# Altium schematic sheet Sheet2.SchDoc
size 431 x 279 mm; SheetNumber: 1; SheetTotal: 1; SPICEModelCacheDONSCKSV: <root> / <DocumentId>DONSCKSV</DocumentId> / </root>
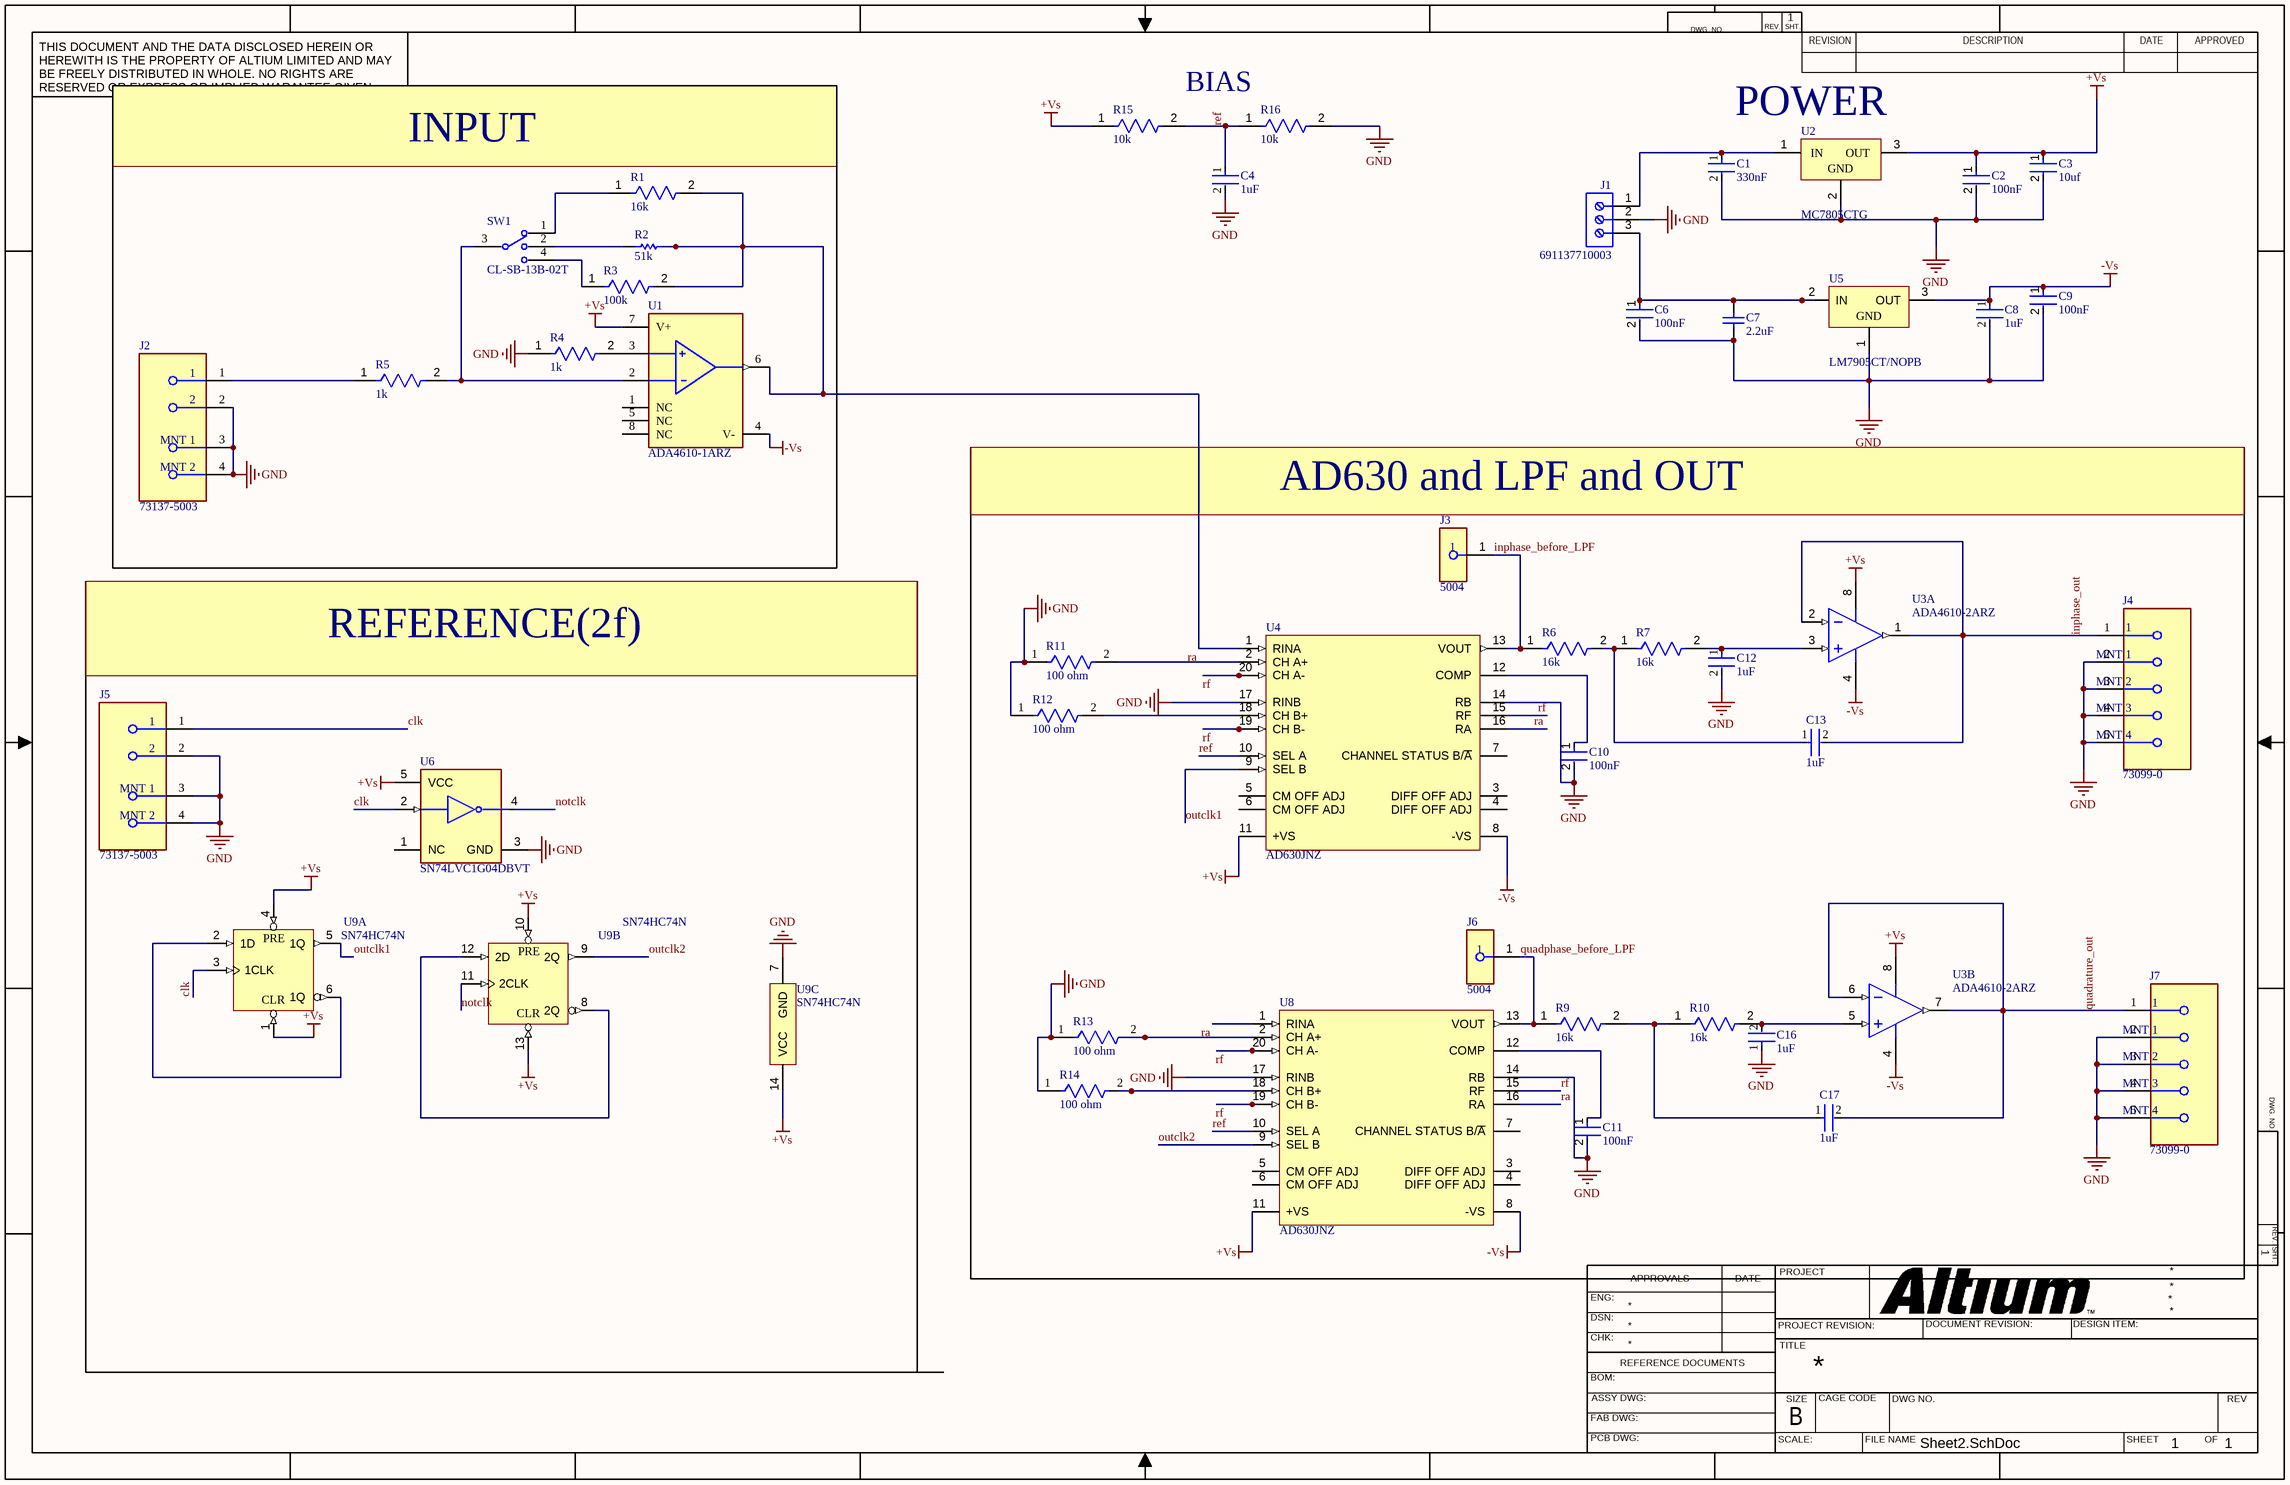
[diagram p0: Sheet2.SchDoc]

## Parts
C1  330nF  [FP-GRM155-0_1-MFG]
C2  100nF  [FP-CL21-IPC_C]
C3  10uf  [FP-CL21-IPC_A]
C4  1uF  [FP-GCM188-0_1-MFG]
C6  100nF  [FP-CL21-IPC_C]
C7  2.2uF  [CAPC2013X145X50LL20T25]
C8  1uF  [FP-GCM188-0_1-MFG]
C9  100nF  [FP-CL21-IPC_C]
C10  100nF  [FP-CL21-IPC_C]
C11  100nF  [FP-CL21-IPC_C]
C12  1uF  [FP-GCM188-0_1-MFG]
C13  1uF  [FP-GCM188-0_1-MFG]
C16  1uF  [FP-GCM188-0_1-MFG]
C17  1uF  [FP-GCM188-0_1-MFG]
J1  691137710003  [691137710003]
J2  73137-5003  [FP-73137-5003-MFG]
J3  5004  [FP-5004-MFG]
J4  73099-0  [FP-73099-0-MFG]
J5  73137-5003  [FP-73137-5003-MFG]
J6  5004  [FP-5004-MFG]
J7  73099-0  [FP-73099-0-MFG]
R1  16k  [FP-RT0603-MFG]
R2  51k  [RESC1608X55X25LL10T15]
R3  100k  [FP-RC0603-0_55-MFG]
R4  1k  [FP-AC0603-IPC_C]
R5  1k  [FP-AC0603-IPC_C]
R6  16k  [FP-RT0603-MFG]
R7  16k  [FP-RT0603-MFG]
R9  16k  [FP-RT0603-MFG]
R10  16k  [FP-RT0603-MFG]
R11  100 ohm  [FP-RC0603-0_55-MFG]
R12  100 ohm  [FP-RC0603-0_55-MFG]
R13  100 ohm  [FP-RC0603-0_55-MFG]
R14  100 ohm  [FP-RC0603-0_55-MFG]
R15  10k  [FP-RC0603-0_55-IPC_C]
R16  10k  [FP-RC0603-0_55-IPC_C]
SW1  CL-SB-13B-02T  [FP-CL-SB-13B-02T-MFG]
U1  ADA4610-1ARZ  [FP-R-8-IPC_A]
U2  MC7805CTG  [ONSC-TO-220-3-221AB-01]
U3  ADA4610-2ARZ  [ADI-R-8_N]  (parts A,B of 2)
U4  AD630JNZ  [ADI-N-20]
U5  LM7905CT/NOPB  [NDE0003A]
U6  SN74LVC1G04DBVT  [FP-DBV0005A-IPC_C]
U8  AD630JNZ  [ADI-N-20]
U9  SN74HC74N  [N0014A]  (parts A,B,C of 3)

## Blocks framed on the sheet
INPUT: J2 R1-R5 SW1 U1
AD630 and LPF and OUT: C10-C13 C16 C17 J3 J4 J6 J7 R6 R7 R9-R14 U3 U4 U8

## Nets
+Vs: C2.1 C3.1 R15.1 U1.7(V+) U2.3(OUT) U3.8(+V) U4.11(+VS) U6.5(VCC) U8.11(+VS) U9.1(1~{CLR}) U9.4(1~{PRE}) U9.10(2~{PRE}) U9.13(2~{CLR}) U9.14(VCC)
-Vs: C8.1 C9.1 U1.4(V-) U3.4(-V) U4.8(-VS) U5.3(OUT) U8.8(-VS)
GND: C1.2 C2.2 C3.2 C4.2 C6.2 C7.1 C8.2 C9.2 C10.2 C11.2 C12.2 C16.1 J1.2 J2.2 J2.3(MNT_1) J2.4(MNT_2) J4.2(MNT_1) J4.3(MNT_2) J4.4(MNT_3) J4.5(MNT_4) J5.2 J5.3(MNT_1) J5.4(MNT_2) J7.2(MNT_1) J7.3(MNT_2) J7.4(MNT_3) J7.5(MNT_4) R4.1 R11.1 R12.1 R13.1 R14.1 R16.2 U2.2(GND) U4.14(RB) U4.17(RINB) U5.1(GND) U6.3(GND) U8.14(RB) U8.17(RINB) U9.7(GND)
clk: J5.1 U6.2(A) U9.3(1CLK)
inphase_before_LPF: J3.1 R6.1 U4.13(VOUT)
inphase_out: C13.2 J4.1 U3.1(OUT_A) U3.2(-IN_A)
notclk: U6.4(Y) U9.11(2CLK)
outclk1: U4.9(SEL_B) U9.5(1Q)
outclk2: U8.9(SEL_B) U9.9(2Q)
quadphase_before_LPF: J6.1 R9.1 U8.13(VOUT)
quadrature_out: C17.2 J7.1 U3.6(-IN_B) U3.7(OUT_B)
ra: R1.2 R2.2 R3.2 U1.6(OUT) U4.1(RINA) U4.16(RA) U8.1(RINA) U8.16(RA)
ref: C4.1 R15.2 R16.1 U4.10(SEL_A) U8.10(SEL_A)
rf: U4.15(RF) U4.19(CH_B-) U4.20(CH_A-) U8.15(RF) U8.19(CH_B-) U8.20(CH_A-)
NetC1_1: C1.1 J1.1 U2.1(IN)
NetC6_1: C6.1 C7.2 J1.3 U5.2(IN)
NetC10_1: C10.1 U4.12(COMP)
NetC11_1: C11.1 U8.12(COMP)
NetC12_1: C12.1 R7.2 U3.3(+IN_A)
NetC13_1: C13.1 R6.2 R7.1
NetC16_2: C16.2 R10.2 U3.5(+IN_B)
NetC17_1: C17.1 R9.2 R10.1
NetJ2_1: J2.1 R5.1
NetR1_1: R1.1 SW1.1
NetR2_1: R2.1 SW1.2
NetR3_1: R3.1 SW1.4
NetR4_2: R4.2 U1.3(+IN)
NetR5_2: R5.2 SW1.3(C) U1.2(-IN)
NetR11_2: R11.2 U4.2(CH_A+)
NetR12_2: R12.2 U4.18(CH_B+)
NetR13_2: R13.2 U8.2(CH_A+)
NetR14_2: R14.2 U8.18(CH_B+)
NetU9_2: U9.2(1D) U9.6(1Q)
NetU9_8: U9.8(2Q) U9.12(2D)

Not connected (* = marked no-connect by the designer): U1 1(NC) 5(NC) 8(NC); U4 3(DIFF_OFF_ADJ) 4(DIFF_OFF_ADJ) 5(CM_OFF_ADJ) 6(CM_OFF_ADJ) 7(CHANNEL_STATUS_B/~{A}); U6 1(NC); U8 3(DIFF_OFF_ADJ) 4(DIFF_OFF_ADJ) 5(CM_OFF_ADJ) 6(CM_OFF_ADJ) 7(CHANNEL_STATUS_B/~{A})

## Notes on the sheet
- BIAS
- POWER
- REFERENCE(2f)
- DWG. NO.
- REV.
- SHT.
- THIS DOCUMENT AND THE DATA DISCLOSED HEREIN OR HEREWITH IS THE PROPERTY OF ALTIUM LIMITED AND MAY BE FREELY DISTRIBUTED IN WHOLE. NO RIGHTS ARE RESERVED OR EXPRESS OR IMPLIED WARANTEE GIVEN.
- REVISION
- DESCRIPTION
- DATE
- APPROVED
- ENG:
- APPROVALS
- PROJECT
- DSN:
- CHK:
- REFERENCE DOCUMENTS
- PROJECT REVISION:
- TITLE
- DOCUMENT REVISION:
- DESIGN ITEM:
- BOM:
- FAB DWG:
- PCB DWG:
- ASSY DWG:
- SCALE:
- SIZE
- B
- CAGE CODE
- FILE NAME
- DWG NO.
- SHEET
- OF
- REV
- (in symbol CMP-1616-00096-3, part A) PRE; CLR
- (in symbol CMP-1616-00096-3, part B) PRE; CLR

## Library data of the parts
C1 = CMP-00260-135708718-1: GRM155R61H334KE01J Multilayer Ceramic Capacitor, 0.33 uF, 50 V, ± 10%, X5R, 0402 [1005 Metric]; Voltage Rating (DC): 50V; Length: 1mm; Lifecycle Status: Production; Case/Package: 0402; Max Operating Temperature: 85°C; Min Operating Temperature: -55°C; Width: 500µm; Thickness: 500µm; Dielectric: X5R; Capacitance: 330nF; Material: Ceramic; NexarPartId: 135708718; Tolerance: 10%; Voltage Rating: 50V; Height: 600µm
C2 C6 C9-C11 = CMP-2000-05017-2: CL21 Series 0805 100nF 50V ±10% Tolerance X7R Multilayer Ceramic Chip Capacitor; Depth: 1.25mm; Height: 0.85mm; Width: 0.049inch; Tolerance: 10%; Case Code (Metric): 2012; Case Code (Imperial): 0805; Material: Ceramic; Thickness: 0.037inch; Min Operating Temperature: -55°C; Contact Plating: Tin; Length: 2mm; Mount: Surface Mount; Voltage Rating (DC): 50V; Lead Free: Lead Free; Dielectric: X7R; Radiation Hardening: No; Capacitance: 100nF; Voltage Rating: 50V; Case/Package: 0805; Packaging: Tape and Reel; Max Operating Temperature: 125°C; Voltage: 50V
C3 = CMP-13271-002975-1: CL21 Series 0805 10uF 25V ±10% Tolerance X5R Multilayer Ceramic Chip Capacitor; Case Code (Imperial): 0805; Length: 2mm; Case/Package: 0805; Packaging: Tape and Reel; Width: 0.049inch; Tolerance: 10%; Mount: Surface Mount; Min Operating Temperature: -55°C; Thickness: 0.057inch; Height: 1.25mm; Dielectric: X5R; Package Quantity: 1; Depth: 1.25mm; Capacitance: 10uF; Voltage Rating: 25V; Case Code (Metric): 2012; Max Operating Temperature: 85°C; Radiation Hardening: No
C4 C8 C12 C13 C16 C17 = CMP-2006-02363-4: Manufacturer Lifecycle Status: IN PRODUCTION; NexarPartId: 18909256; Dielectric: X7R; Material: Ceramic; Tolerance: 10%; Capacitance: 1µF; Voltage Rating: 25V; Thickness: 889µm; Max Operating Temperature: 125°C; Radiation Hardening: No; Weight: 6.293594mg; Lead Free: Lead Free; Mount: Surface Mount; Case Code (Imperial): 0603; REACH SVHC: No SVHC; Lifecycle Status: Production; Depth: 800µm; Min Operating Temperature: -55°C; Height: 800µm; Case Code (Metric): 1608; Case/Package: 0603; Voltage: 25V; Packaging: Cut Tape; Length: 1.6mm; Termination: SMD/SMT; Width: 787.4µm; Voltage Rating (DC): 25V; RoHS: Compliant; Schedule B: 8532240020, 8532240020; Ratings: AEC-Q200
C7 = CMP-2007-01169-1: Manufacturer: Kemet; Part Number: C0805C225K4RAC7800
J1 = CMP-1502-03325-3: Terminal Block, 5MM Pitch, Horizontal, Pressure Clamp Glow Wire, Pcb, 3PINS, Gr; RoHS: Non-Compliant; Number of Pins: 3; Lead Pitch: 5mm; Packaging: Box
J2 J5 = CMP-00257-00776508-1: 73137-5003 Connector BNC Female 0Hz To 2GHz 50 Ohm Solder Right Angle Through Hole Gold Tray; NexarPartId: 776508; Manufacturer Lifecycle Status: ACTIVE; Body Plating: Nickel; Polarity: Normal; Connector Type: PCB; Number of Contacts: 1; Impedance: 50Ω; Body Material: PBT, Polybutylene; Voltage Rating: 500V; Dielectric Material: Polypropylene; Min Operating Temperature: -20°C; Orientation: Right Angle, Straight; Termination: Solder; Gender: Female; RoHS: Compliant; REACH SVHC: No SVHC; Lifecycle Status: Production; Country of Origin: US; Contact Plating: Gold; Depth: 14.76mm; Lead Free: Lead Free; Mount: Through Hole; Length: 35.18mm; Max Operating Temperature: 70°C; Frequency: 2GHz; Radiation Hardening: No; Height: 13.2mm; Plating: Nickel; Contact Material: Bronze, Gold, Nickel, Tin; Insulation Material: Polyester; Halogen Free: Low Halogen
J3 J6 = CMP-2000-05575-2: PC TEST POINT MINIATURE YELLOW; Manufacturer: Keystone; Number Of Contacts: 1; Is Female: yes; Device Class L1: Connectors; Manufacturer Part Number: 5004; Digikey Description: PC TEST POINT MINIATURE YELLOW; ComponentLink2URL: https://www.keyelco.com/product-pdf.cfm?p=1313; Lead Free: Yes; ComponentLink2Description: Datasheet; Category: Conn; Height: 4.72mm; Octopart: https://octopart.com/5004-keystone-28591; Mouser Description: TEST POINT PC MINI .040"D YELLOW; Device Class L3: unset; Contact Material: Silver; Package: 5004; Automotive: No; Device Class L2: unset; RoHS: TRUE
J4 J7 = CMP-73906-000007-1: R/A 4MM MOUNTG SAFE JACK/PCB BLK
R1 R6 R7 R9 R10 = CMP-2000-04660-2: RES SMD 16K OHM 1% 1/10W 0603; Manufacturer Part Number: RT0603FRE0716KL; Manufacturer: Yageo; Voltage Rating: 75V; Temperature Coefficient: 50 ppm/°C; Value: 16KΩ; Power Rating: 0.1W; Tolerance: 0.01; Package: RT0603; Automotive: No; Octopart: https://octopart.com/rt0603fre0716kl-yageo-1480398; Device Class L1: Passive Components; Composition: Thin Film; Height: 0.55mm; Footprint Url: http://www.yageo.com/exep/pages/download/literatures/PYu-R_Mount_10.pdf; Series: RT; Lead Free: Yes; Device Class L2: Resistors; Device Class L3: Chip SMD Resistors; ComponentLink2Description: Datasheet; Mouser Description: Thin Film Resistors - SMD 1/10W 16K ohm 1% 50ppm; ComponentLink2URL: http://www.yageo.com/documents/recent/PYu-RT_1-to-0.01_RoHS_L_9.pdf; Ipc Land Pattern Name: RESC16080X45; Resistance: 16KΩ; Category: Res; RoHS: TRUE; Temperature Range Low: -55°C; Temperature Range High: +155°C; Temperature: -55°C to +155°C; Digikey Description: RES SMD 16K OHM 1% 1/10W 0603
R2 = CMP-2000-04226-1: Manufacturer: Yageo; Part Number: RC0603FR-1351KL
R3 = CMP-2100-03662-2: RES SMD 100K OHM 1% 1/10W 0603; Voltage Rating (DC): 50V; Resistance: 100kR; Max Power Dissipation: 100mW; Temperature Coefficient: 100ppm/°C; Working Voltage: 75V; Length: 1.6mm; Lead Free: Lead Free; Number of Terminations: 2; Packaging: Tape and Reel; Voltage Rating: 50V; Termination: SMD/SMT; Width: 0.8mm; Resistor Type: Thick Film; Resistance Tolerance: 1%; Features: Moisture Resistant; Height: 0.45mm; Construction: Rectangular; Case/Package: 0603; Military Standard: Not; Case Code (Imperial): 0603; Series: RC; Technology: THICK FILM; Depth: 0.8mm; RoHS Compliant: Yes; REACH SVHC: No SVHC; Min Operating Temperature: -55°C; Case Code (Metric): 1608; Max Operating Temperature: 155°C; Power Rating: 100mW; Number of Pins: 2; Tolerance: 1%
R4 R5 = CMP-03412-045511-1: RES 1kΩ 1.00% 0.1W 0603; Power Rating: 100mW; Resistance: 1kR; Tolerance: 1%; Temperature Coefficient: 100ppm/°C; Voltage Rating: 50V; Max Operating Temperature: 155°C; Height: 0.45mm; RoHS Compliant: Yes; Series: AC; Termination: SMD/SMT; Length: 1.6mm; Packaging: Tape and Reel; Case/Package: 0603; Case Code (Imperial): 0603; Min Operating Temperature: -55°C; Case Code (Metric): 1608; Width: 0.8mm
R11-R14 = CMP-2100-03663-2: NexarPartId: 55402879; Voltage Rating: 50V; Power Rating: 100mW; Tolerance: 1%; Temperature Coefficient: 100ppm/°C; Resistance: 100Ω; Case/Package: 0603; Military Standard: Not; REACH SVHC: Unknown; Case Code (Metric): 0603; Max Operating Temperature: 155°C; Schedule B: 8533210045, 8533210045; Height: 450µm; Length: 1.6mm; Lead Free: Lead Free; Packaging: Tape & Reel; Case Code (Imperial): 0603; Composition: Thick Film; Min Operating Temperature: -55°C; Voltage Rating (DC): 50V; RoHS: Compliant; Depth: 800µm; Number of Pins: 2; Termination: SMD/SMT; Width: 800µm
R15 R16 = CMP-2100-03664-2: RES 10K OHM 1% 1/10W 0603; Voltage Rating: 75V; Voltage Rating (DC): 50V; Resistance: 10kR; Power Rating: 100mW; Temperature Coefficient: 100ppm/°C; Depth: 0.8mm; Termination: SMD/SMT; Resistor Type: Thick Film; Series: RC; Construction: Rectangular; Features: Moisture Resistant; Packaging: Tape and Reel; Min Operating Temperature: -55°C; Number of Terminations: 2; Lead Pitch: 0.3mm; RoHS Compliant: Yes; Case/Package: 0603; Resistance Tolerance: 1%; Military Standard: Not; Weight: 7.1E-05oz; Number of Pins: 2; Tolerance: 1%; Length: 1.6mm; Case Code (Imperial): 0603; Lead Free: Lead Free; Width: 0.8mm; Max Power Dissipation: 100mW; Height: 0.45mm; Max Operating Temperature: 155°C; Case Code (Metric): 1608; Size Code: 0603
SW1 = CMP-08360-77011255-1: CL-SB-13B-02T Switch Slide ON-ON-ON SP3T Top 200mA 12VDC 10000Cycles Gullwing T/R; Actuator Length: 2mm; Contact Style: Non-Shorting; Electrical Life: 10kcycles; Contact Resistance: 70mΩ; Voltage Rating (DC): 12V; Actuator Material: Nylon, Polyamide; RoHS: Compliant; Contact Current Rating: 200mA; Packaging: Tape & Reel (TR); Termination: Gull Wing; Orientation: Vertical; Lead Free: Lead Free; Current Rating: 200mA; Mount: Surface Mount; Height: 6.1mm; Switch Travel: 2mm; Switch Function: On-On-On; Contact Plating: Gold; Min Operating Temperature: -40°C; Throw Configuration: SP3T; Life (Cycles): 10kcycles; NexarPartId: 77011255; Contact Material: Copper; Max Operating Temperature: 85°C
U1 = CMP-09116-000135-1: IC OPAMP JFET 1 CIRCUIT 8SOIC; Slew Rate: 61V/µs; Gain Bandwidth Product: 16.3MHz; Input Bias Current: 5pA; Operating Supply Current: 1.6mA; Min Dual Supply Voltage: 4.5V; -3db Bandwidth: 9.5MHz; Input Offset Voltage (Vos): 400uV; Voltage Gain: 104dB; Number of Circuits: 1; Common Mode Rejection Ratio: 100dB; Output Current per Channel: 79mA; Max Supply Voltage: 15V; Min Operating Temperature: -40°C; Contact Plating: Tin; Packaging: Rail/Tube; Case/Package: SOIC; Max Operating Temperature: 125°C; Number of Pins: 8; Mount: Surface Mount; Power Supply Rejection Ratio (PSRR): 104dB; Max Dual Supply Voltage: 15V; RoHS Compliant: Yes; Lead Free: Contains Lead
U2 = CMP-2000-04928-1: Positive Voltage Regulator, 1 A, 5 V, 0 to 125 degC, 3-Pin TO-220, RoHS, Tube; Manufacturer: ON Semiconductor; Resistance, Thermal, Junction to Case: 5degC/W; Voltage, Supply: 35V; Regulator Function: Standard; Temperature, Operating, Maximum: +125degC; Load Regulation: 25mV; Regulator Type: PositiveVoltageOut; Current, Output, Maximum: 1A; Regulation, Load: 1.3mV; Number of Outputs: 1; Temperature, Operating, Range: 0to+125degC; Regulation, Line: 0.5mV; Line Regulation: 20mV; Voltage, Input Range: Maximumof35V; Output Type: Fixed; Current, Quiescent Supply: 6.5mA; Dropout Voltage: 2V; Temperature, Operating, Minimum: 0degC; Package Version: Rev. A, 11/2010; Current, Supply: 3.2mA; Voltage, Output: 5V; Voltage, Noise: 10μV/V; Package Type: TO-220; Voltage, Input, High Level: 35V; Datasheet URL: http://www.onsemi.com/pub_link/Collateral/MC7800-D.PDF; Dimensions: 10.28x4.82x15.75mm; Width: 4.82mm; Type: VoltageRegulator; Mounting Type: ThroughHole; Polarity: Positive; Datasheet Version: Rev. 27, 11/2014; Height: 15.75mm; Dropout Voltage Measurement Current: 1A; Package Description: 3-Pin Flange Mount, Vertical Straight Lead, Body 9.97 x 4.445 mm, Pitch 2.54 mm; Manufacturer URL: http://www.onsemi.com/; Voltage, Dropout: 2V; Length: 10.28mm; Number of Pins: 3; Package Reference: TO-220-3-221AB-01
U3 = CMP-0384-01191-1: Double Channel Low Offset Voltage Drift Operational Amplifier, 10.6 MHz BW, 25 V/us SR, Industrial, 8-pin SOIC (R-8), Tube; Manufacturer: Analog Devices; V Span Min: 9V; Input Offset Voltage: 200uV; Input Bias Current: 5pA; V Span Max: 30V; Amplifiers Per Package: 2; Iq/Amp: 1.6mA; Slew Rate: 25V/us; PackageReference: R-8; ComponentLink2Description: Datasheet; DatasheetVersion: Rev. B; ComponentLink3Description: Package Specification; Generic Part Number: ADA4610-2; PackageDescription: 8-Pin Standard Small Outline Package, Body 3.9 x 4.9 mm, Pitch 1.27 mm; Packing: Tube; ComponentLink1URL: http://www.analog.com/en/index.html; Small Signal Bandwidth: 10.6MHz; PartNumber: ADA4610-2ARZ; Code_JEDEC: MS-012-AA; Mounting Technology: Surface Mount; ComponentLink3URL: http://www.analog.com/static/imported-files/packages/PKG_PDF/SOIC_Narrow%20(R)/R_8.pdf; PackageVersion: 060506-A; ComponentLink1Description: Manufacturer URL; ComponentLink2URL: http://www.analog.com/static/imported-files/data_sheets/ADA4610-2.pdf
U4 U8 = CMP-0285-00007-1: Balanced Modulator/Demodulator, 2MHz Max RF Frequency, N-20, 18 Tube; Min RF Frequency (MHz): 0Hz; PackageReference: N-20; Code_JEDEC: MS-001; PackageVersion: 070706-A; PackageDescription: 20-Lead Plastic Dual In-Line Package [PDIP]; ComponentLink1Description: Manufacturer URL; ComponentLink3URL: http://www.analog.com/static/imported-files/packages/50601349676519N_20.pdf; DatasheetVersion: RevE; ComponentLink2Description: Datasheet; Max RF Frequency (MHz): 2MHz; ComponentLink3Description: Package Specification; ComponentLink1URL: www.analog.com; ComponentLink2URL: http://www.analog.com/static/imported-files/data_sheets/AD630.pdf
U5 = CMP-0062-02481-3: 3-Terminal Negative Regulator, 3-pin TO-220, Pb-Free; Manufacturer: Texas Instruments; PackageTopMarking: NSUZXYTTE#*LM7905CT; CompType: LDO IC; PowerWise: N; PackageDescription: TO-220, Molded, 3 Lead, Straight; ComponentLink1Description: Datasheet URL; ComponentLink1URL: http://www.ti.com/general/docs/lit/getliterature.tsp?genericPartNumber=LM7905&fileType=pdf; PackageReference: NDE0003A; RoHS: Y; PinCount: 3
U6 = CMP-0859-00133-4: IC INVERTER 1CH 1-INP SOT23-5; Manufacturer: Texas Instruments; Nominal Supply Current: 10uA; Number Of Inputs: 1; Propagation Delay: 3.7ns; Min Supply Voltage: 1.65V; Standoff Height: 0mm; Max Supply Voltage: 5.5V; Octopart: https://octopart.com/sn74lvc1g04dbvt-texas+instruments-881539; Ipc Land Pattern Name: SOT95P280X118-5; ComponentLink2URL: http://www.ti.com/lit/ds/symlink/sn74lvc1g04.pdf; Device Class L3: Logic Gates; Logic Function Desc: Inverter; Lead Free: Yes; Number Of Outputs: 1; Temperature Range Low: -40°C; Device Class L1: Integrated Circuits (ICs); Manufacturer Part Number: SN74LVC1G04DBVT; Ambient Temperature Range High: +125°C; Temperature Range High: +125°C; Category: IC; Package: DBV0005A; Mouser Description: Inverters SINGLE INVERTER; RoHS: TRUE; Digikey Description: IC INVERTER 1CH 1-INP SOT23-5; Temperature: -40°C to +125°C; Device Class L2: Logic ICs; Height: 1.45mm; Ambient Temperature Range Low: -40°C; Number Of Circuits: 1; Automotive: No; ComponentLink2Description: Datasheet
U9 = CMP-1616-00096-3: Dual D-Type Positive-Edge-Triggered Flip-Flops With Clear and Preset, N0014A, TUBE; Manufacturer: Texas Instruments; VCC(Min)(V): 2; F @ Nom Voltage(Max)(Mhz): 28; Voltage(Nom)(V): 3.3,5; Output Drive (IOL/IOH)(Max)(mA): 5.2/-5.2; Output: 3S; ICC @ Nom Voltage(Max)(mA): 0.04; Output Logic: Inverted,Non-inverted; Technology Family: HC; 3-State Output: No; VCC(Max)(V): 6; Output Type: CMOS; tpd @ Nom Voltage(Max)(ns): 37; Rating: Catalog; Operating Temperature Range(C): -40 to 85; DatasheetVersion: SCLS094D; Code_JEDEC: MS-001; Bits(#): 2; Schmitt Trigger: No; PackageReference: N0014A; Generic Part Number: SN74HC74; Input Type: CMOS